# Altium schematic sheet can.SchDoc
size A4
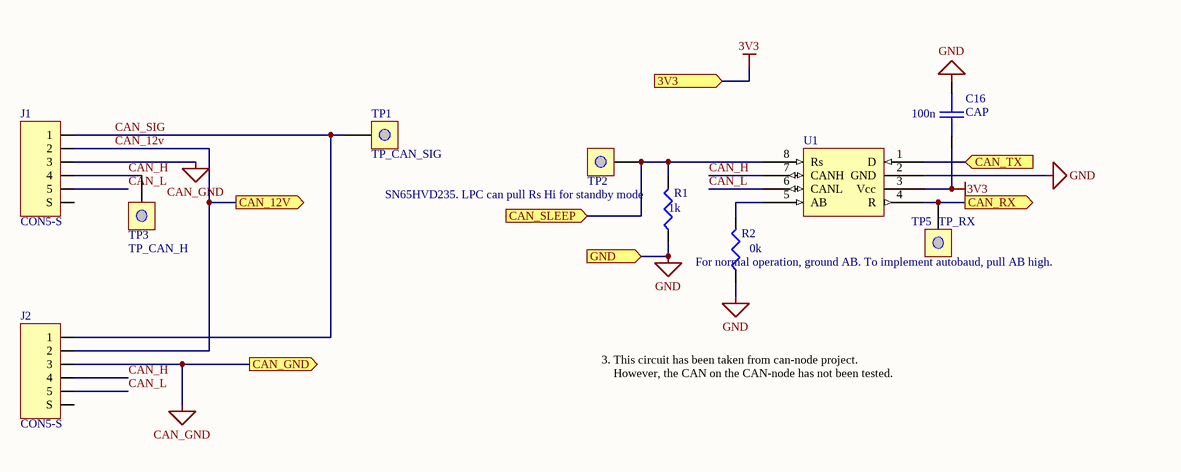
[diagram p0: can.SchDoc]

## Parts
C16  CAP  value 100n  [0603]
J1  CON5-S  [TRIAD5F]
J2  CON5-S  [TRIAD5F]
R1  value 1k  [0603]  (hidden comment: RES1)
R2  For normal operation, ground AB. To implement autobaud, pull AB high.  value 0k  [0603]
TP1  TP_CAN_SIG  [TESTPOINT]
TP2  TEST  [TESTPOINT]  (value not drawn)
TP3  TP_CAN_H  [TESTPOINT]
TP5  TP_RX  [TESTPOINT]
U1  SN65HVD235. LPC can pull Rs Hi for standby mode  [SO8]

## Ports
3V3 (in), CAN_12V (out), CAN_GND (out), CAN_RX (out), CAN_SLEEP (in), CAN_TX (in), GND (in)

## Nets
3V3: C16.2 U1.3(Vcc) ; port 3V3
CAN_GND: J1.3 J2.3 ; port CAN_GND
GND: C16.1 R1.1 R2.1 U1.2(GND) ; port GND
CAN_12v: J1.2 J2.2 ; port CAN_12V
CAN_H: J1.4 J2.4 TP3.0(TP) U1.7(CANH)
CAN_L: J1.5 J2.5 U1.6(CANL)
CAN_RX: TP5.0(TP) U1.4(R) ; port CAN_RX
CAN_SIG: J1.1 J2.1 TP1.0(TP)
CAN_SLEEP: R1.2 TP2.0(TP) U1.8(Rs) ; port CAN_SLEEP
CAN_TX: U1.1(D) ; port CAN_TX
NetR2_2: R2.2 U1.5(AB)

Not connected (* = marked no-connect by the designer): J1 0(S); J2 0(S)

## Notes on the sheet
- 3. This circuit has been taken from can-node project.
  However, the CAN on the CAN-node has not been tested.

## Library data of the parts
C16 = CAP: Capacitor
J1 J2 = CON5-S: Connector, 2 pin, with shield @ S
R1 R2 = RES1: Resistor
TP1 = TEST: TEST POINT for 12V on CAN
TP2 TP3 TP5 = TEST: TEST POINT
U1 = SN65HVD235: 3.3V CAN XCVR W/STANDBY